# EAGLE schematic harp analog input v1.0 (EAGLE 9.6.2)

## Sheet 1 of 3
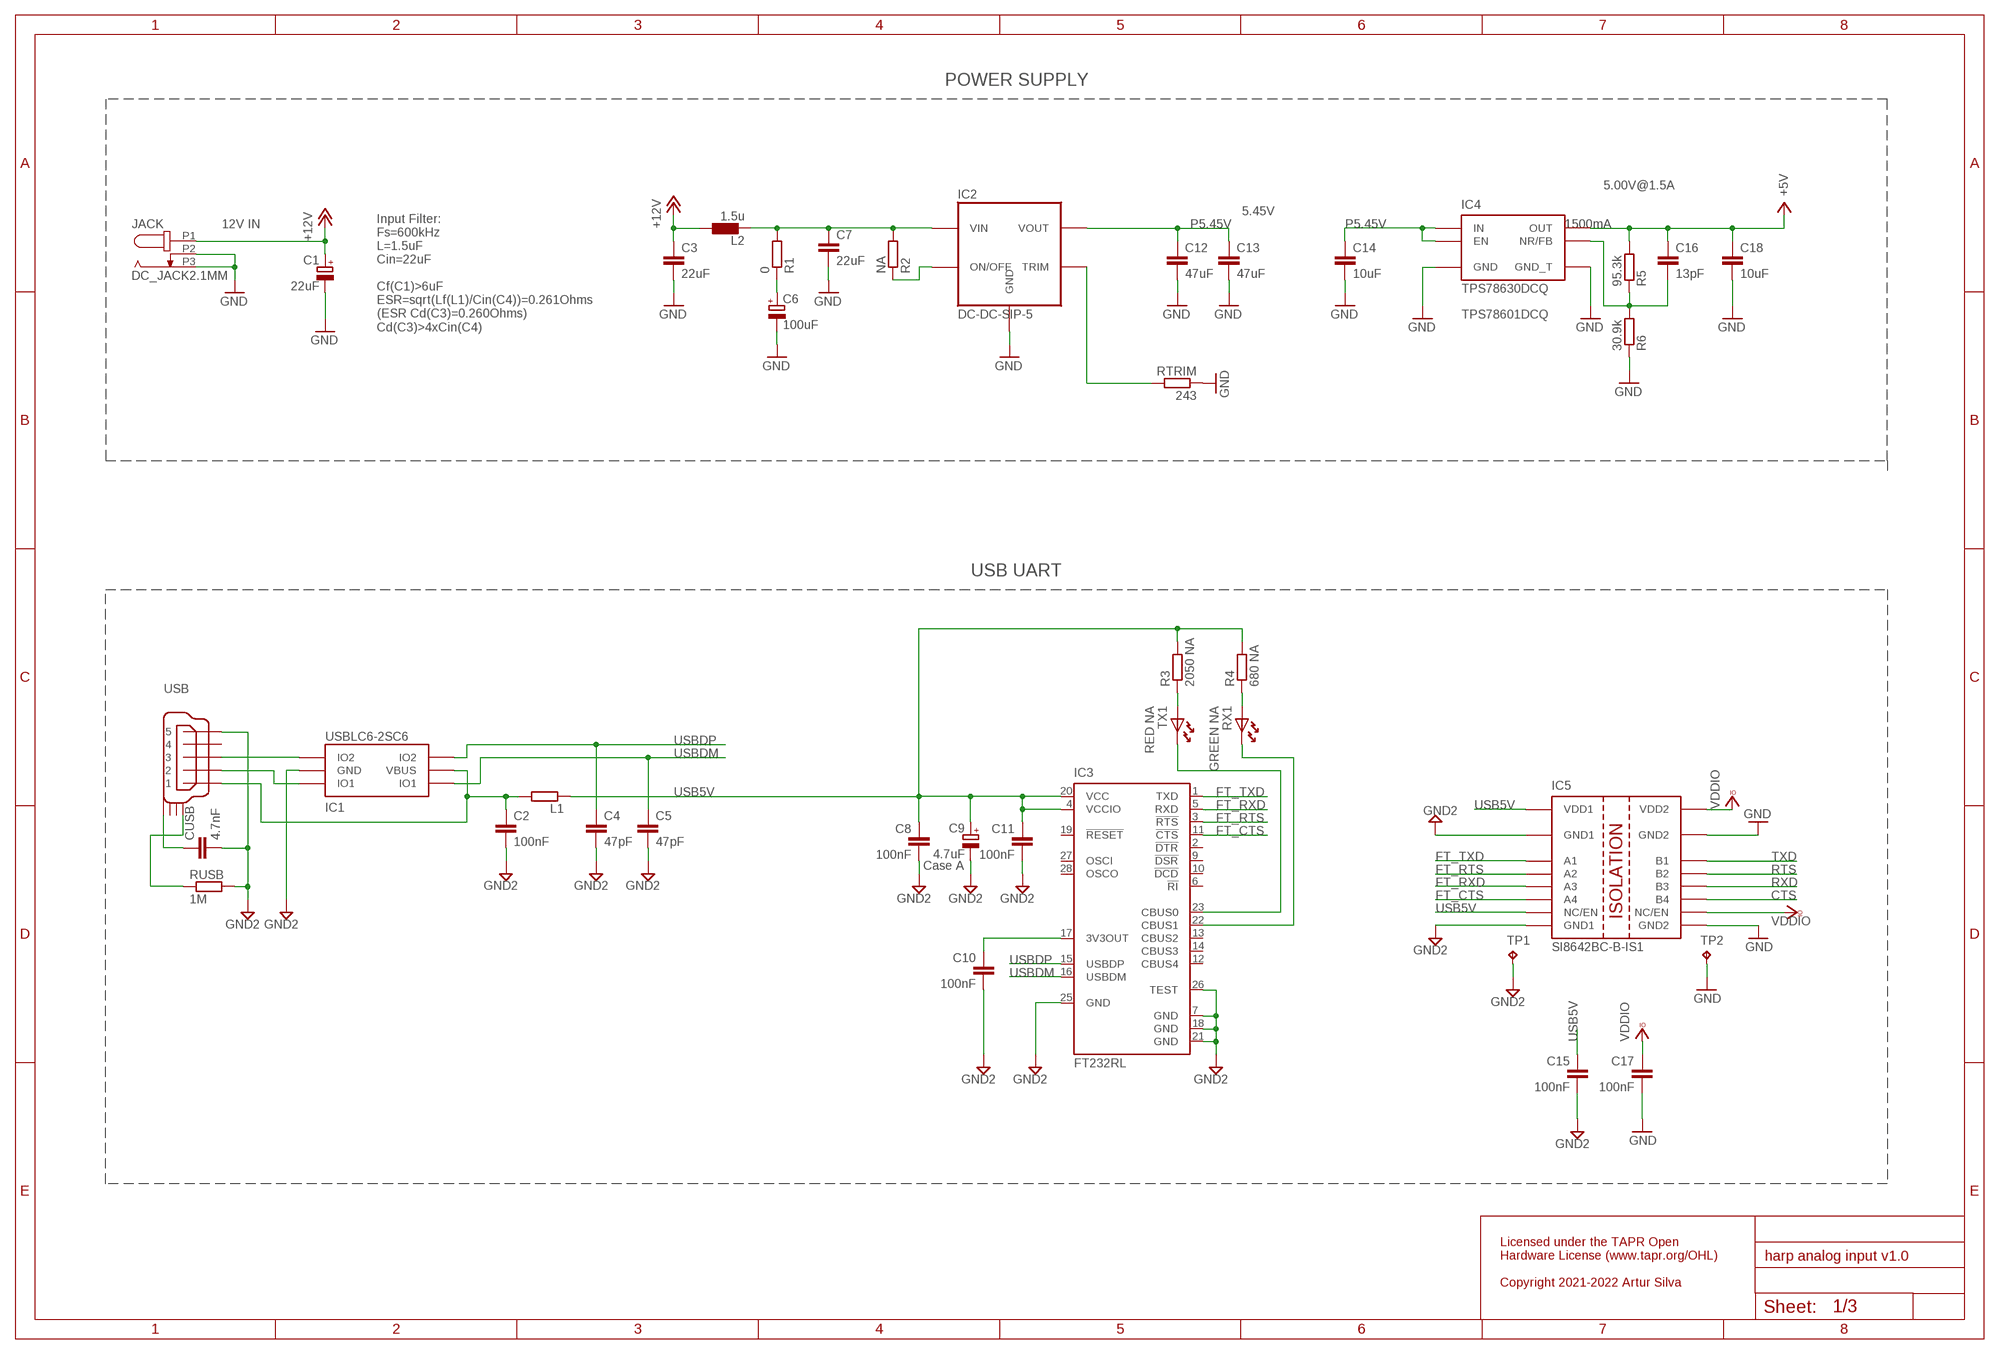
[diagram p0: schematic, sheet 1]

### Parts
C1  22uF  CAP_100UFHAND  [CAP_100UF_HAND]
C2  100nF  C-EUC0402  [C0402]
C3  22uF  C-EUC1210  [C1210]
C4  47pF  C-EUC0402  [C0402]
C5  47pF  C-EUC0402  [C0402]
C6  100uF  CPOL-EUE  [PANASONIC_E]
C7  22uF  C-EUC1210  [C1210]
C8  100nF  C-EUC0402  [C0402]
C9  4.7uF  CPOL-EUA/3216-18W  [A/3216-18W]
C10  100nF  C-EUC0402  [C0402]
C11  100nF  C-EUC0402  [C0402]
C12  47uF  C-EUC1210  [C1210]
C13  47uF  C-EUC1210  [C1210]
C14  10uF  C-EUC0603  [C0603]
C15  100nF  C-EUC0402  [C0402]
C16  13pF  C-EUC0402  [C0402]
C17  100nF  C-EUC0402  [C0402]
C18  10uF  C-EUC0603  [C0603]
CUSB  4.7nF  C-EUC0402  [C0402]
IC1  USBLC6-2SC6  USBLC6-2  [SOT23-6L]
IC2  DC-DC-SIP-5  [SIP-5]
IC3  FT232RL  [SSOP28]
IC4  TPS78630DCQ  TPS78601SON  [SON-8]
IC5  SI8642BC-B-IS1  SI8645  [NSOIC-16]
JACK  DC_JACK2.1MM  [DC_POWER_INPUT_2.1MM]
L1  ???  R-EU_R0805  [R0805]
L2  1.5u  INDLPS4012  [IND_LPS4012]
R1  0  R-EU_R0402  [R0402]
R2  NA  R-EU_R0402  [R0402]
R3  2050 NA  R-EU_R0402  [R0402]
R4  680 NA  R-EU_R0402  [R0402]
R5  95.3k  R-EU_R0402  [R0402]
R6  30.9k  R-EU_R0402  [R0402]
RTRIM  243  R-EU_R0402  [R0402]
RUSB  1M  R-EU_R0402  [R0402]
RX1  GREEN NA  LEDHAND  [LED_HAND]
TP1  TPTP08SQ  [TP08SQ]
TP2  TPTP08SQ  [TP08SQ]
TX1  RED NA  LEDHAND  [LED_HAND]
USB  USB_MINI_B  [240-0002-1]

### Nets
3V3OUT: C10.1 IC3.17(3V3OUT)
+5V: C16.1 C18.1 IC4.P3(OUT) IC4.P4(OUT) R5.2 ; also sheet 2,3
+12V: C1.+ C3.1 JACK.P1 L2.1
CTS: IC5.11(B4) ; also sheet 2
DCIN: C7.1 IC2.P2(VIN) L2.2 R1.2 R2.2
FT_CTS: IC3.11(!CTS) IC5.6(A4)
FT_RTS: IC3.3(!RTS) IC5.4(A2)
FT_RXD: IC3.5(RXD) IC5.5(A3)
FT_TXD: IC3.1(TXD) IC5.3(A1)
GND: C1.- C3.2 C6.- C7.2 C12.2 C13.2 C14.2 C17.2 C18.2 IC2.P3(GND) IC4.P6(GND) IC4.P9(GND_T) IC5.9(GND2) IC5.15(GND2) JACK.P2 JACK.P3 R6.1 RTRIM.1 TP2.TP ; also sheet 2,3
GND2: C2.2 C4.2 C5.2 C8.2 C9.- C10.2 C11.2 C15.2 CUSB.2 IC1.P$2(GND) IC3.7(GND) IC3.18(GND) IC3.21(GND) IC3.25(GND) IC3.26(TEST) IC5.2(GND1) IC5.8(GND1) RUSB.2 TP1.TP USB.P$5
N$5: R4.1 RX1.A
N$7: IC3.22(CBUS1) RX1.K
N$12: IC2.P5(TRIM) RTRIM.2
N$13: IC1.P$3(IO2) USB.P$3
N$15: CUSB.1 USB.SHIELD_4
N$16: IC2.P1(ON/OFF) R2.1
N$20: C16.2 IC4.P5(NR/FB) R5.1 R6.2
N$24: C6.+ R1.1
N$60: C2.1 IC1.P$5(VBUS) L1.2 USB.P$1
N$401: R3.1 TX1.A
N$591: IC3.23(CBUS0) TX1.K
N$601: RUSB.1 USB.SHIELD_1
N$701: IC1.P$1(IO1) USB.P$2
P5.45V: C12.1 C13.1 C14.1 IC2.P4(VOUT) IC4.P1(IN) IC4.P2(IN) IC4.P8(EN)
RTS: IC5.13(B2) ; also sheet 2
RXD: IC5.12(B3) ; also sheet 2
TXD: IC5.14(B1) ; also sheet 2
USB5V: C8.1 C9.+ C11.1 C15.1 IC3.4(VCCIO) IC3.20(VCC) IC5.1(VDD1) IC5.7(NC/EN) L1.1 R3.2 R4.2
USBDM: C5.1 IC1.P$6(IO1) IC3.16(USBDM)
USBDP: C4.1 IC1.P$4(IO2) IC3.15(USBDP)
VCCIO: C17.1 IC5.10(NC/EN) IC5.16(VDD2) ; supply symbol labelled VDDIO ; also sheet 2,3
Unconnected: IC3.2(!DTR) IC3.6(!RI) IC3.9(!DSR) IC3.10(!DCD) IC3.12(CBUS4) IC3.13(CBUS2) IC3.14(CBUS3) IC3.19(!RESET) IC3.27(OSCI) IC3.28(OSCO) USB.P$4 USB.SHIELD_2 USB.SHIELD_3

### Notes on the sheet
- POWER SUPPLY
- 5.00V@1.5A
- 5.45V
- 12V IN | 1500mA
- TPS78601DCQ
- Input Filter:
  Fs=600kHz
  L=1.5uF
  Cin=22uF
  
  Cf(C1)>6uF
  ESR=sqrt(Lf(L1)/Cin(C4))=0.261Ohms
  (ESR Cd(C3)=0.260Ohms)
  Cd(C3)>4xCin(C4)
- USB UART
- Case A
- Licensed under the TAPR Open
  Hardware License (www.tapr.org/OHL)
  
  Copyright 2021-2022 Artur Silva

## Sheet 2 of 3
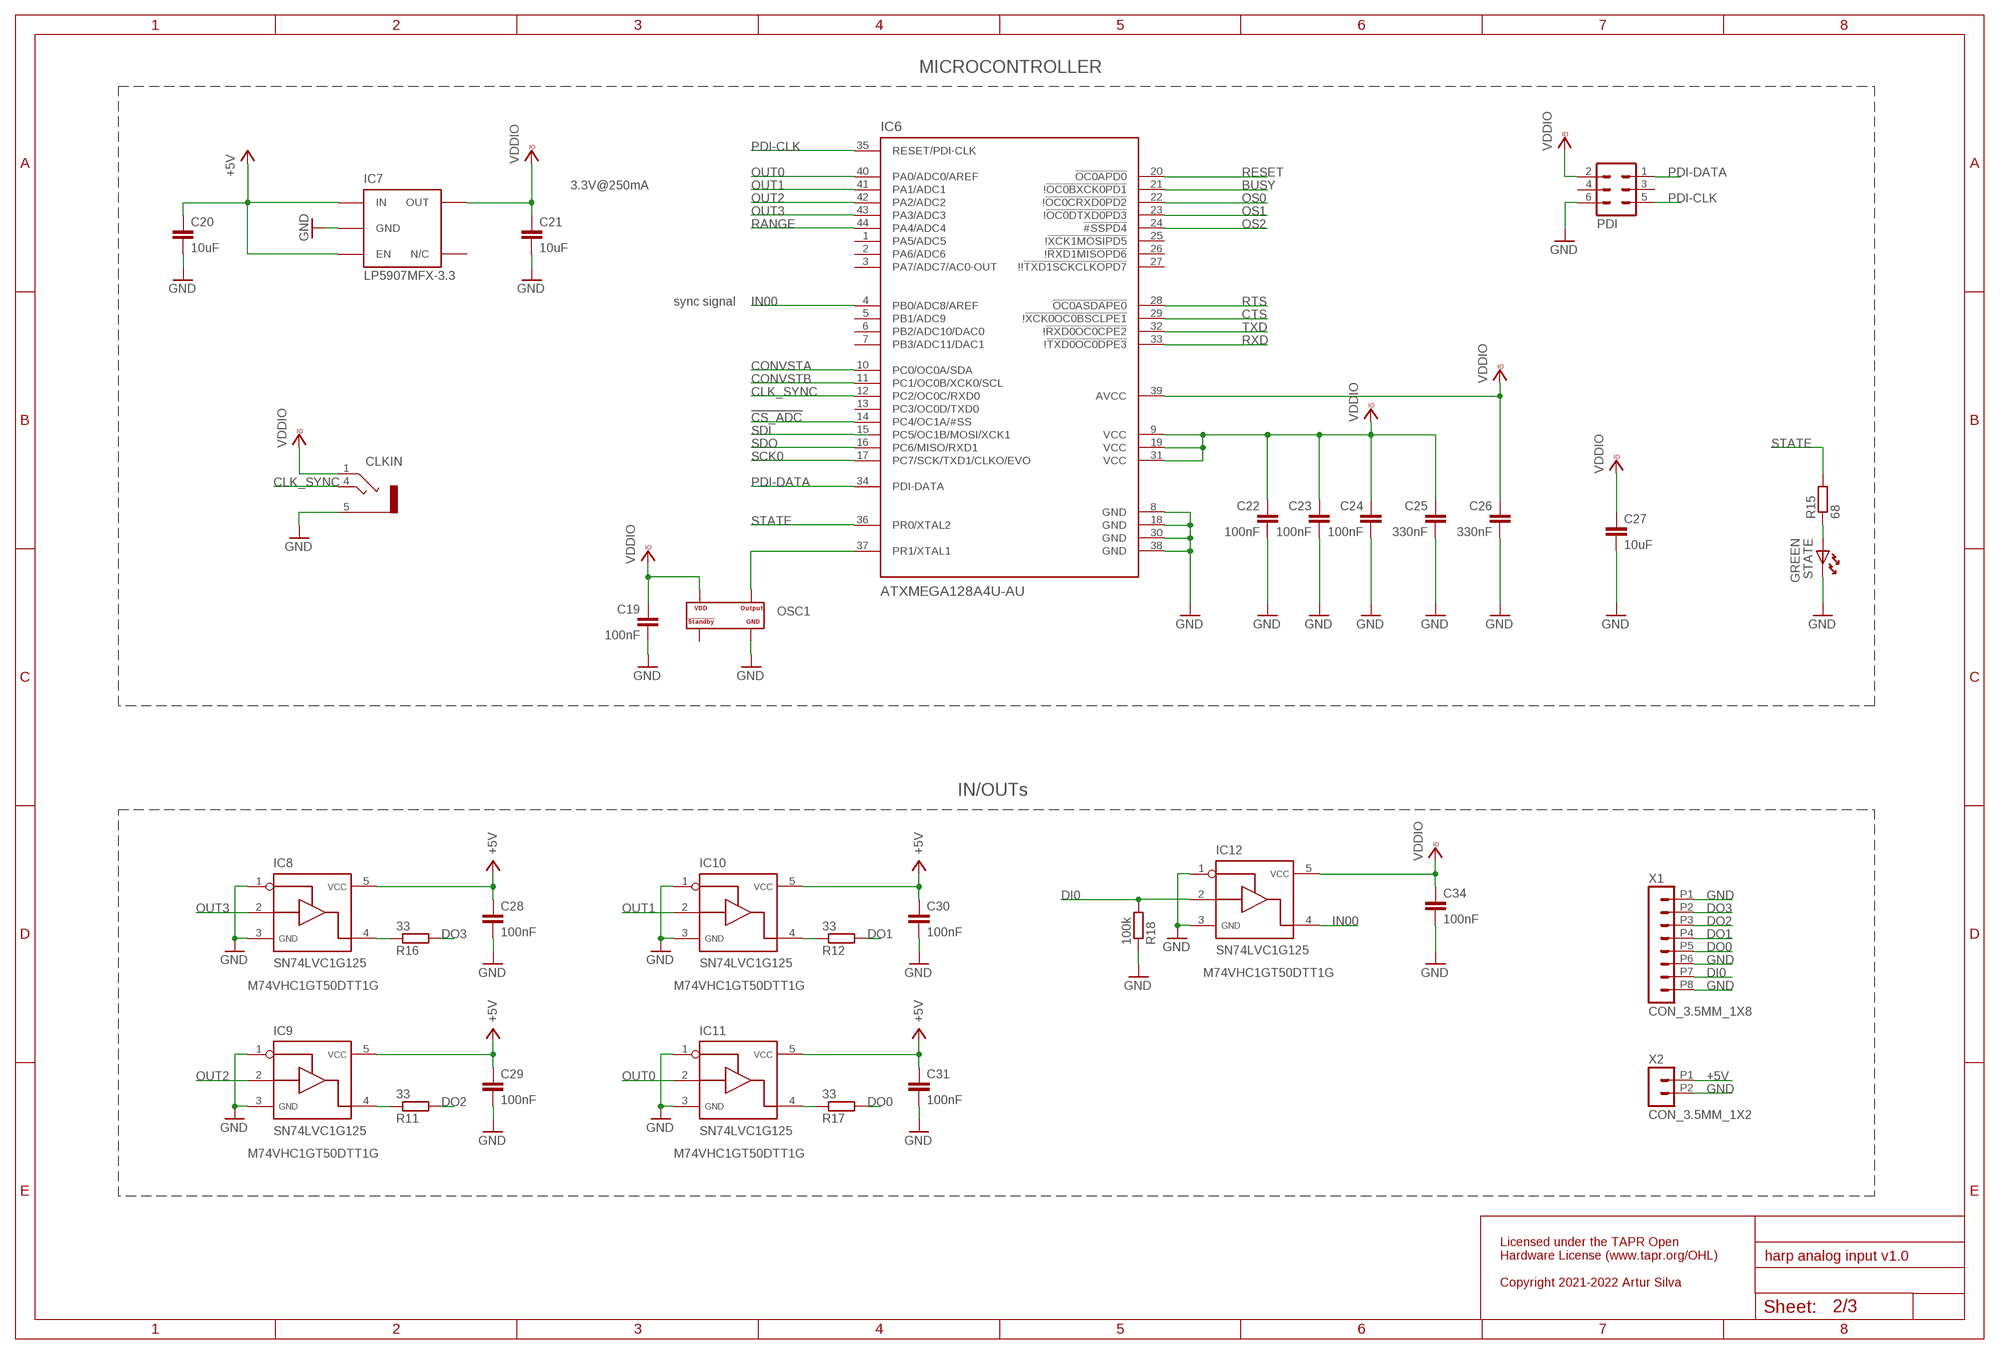
[diagram p1: schematic, sheet 2]

### Parts
C19  100nF  C-EUC0402  [C0402]
C20  10uF  C-EUC0603  [C0603]
C21  10uF  C-EUC0603  [C0603]
C22  100nF  C-EUC0402  [C0402]
C23  100nF  C-EUC0402  [C0402]
C24  100nF  C-EUC0402  [C0402]
C25  330nF  C-EUC0402  [C0402]
C26  330nF  C-EUC0402  [C0402]
C27  10uF  C-EUC0603  [C0603]
C28  100nF  C-EUC0402  [C0402]
C29  100nF  C-EUC0402  [C0402]
C30  100nF  C-EUC0402  [C0402]
C31  100nF  C-EUC0402  [C0402]
C34  100nF  C-EUC0402  [C0402]
CLKIN  STEREO_JACK  [35RASMT2BHNTRX]
IC6  ATXMEGA128A4U-AU  AT-XMEGA-XXA4-AU  [QFP80P1200X1200X120-44N]
IC7  LP5907MFX-3.3  TLV700XX  [TSOT23-5]
IC8  SN74LVC1G125  [SOT23-5]
IC9  SN74LVC1G125  [SOT23-5]
IC10  SN74LVC1G125  [SOT23-5]
IC11  SN74LVC1G125  [SOT23-5]
IC12  SN74LVC1G125  [SOT23-5]
OSC1  OSCILLATOR  [OSCILLATOR_3.2X2.5]
PDI  MA03-2  [MA03-2]
R11  33  R-EU_R0402  [R0402]
R12  33  R-EU_R0402  [R0402]
R15  68  R-EU_R0402  [R0402]
R16  33  R-EU_R0402  [R0402]
R17  33  R-EU_R0402  [R0402]
R18  100k  R-EU_R0402  [R0402]
STATE  GREEN  LEDHAND  [LED_HAND]
X1  CON_3.5MM_1X8  [CON_3.5MM_1X8]
X2  CON_3.5MM_1X2  [CON_3.5MM_1X2]

### Nets
!CS_ADC: IC6.14(PC4/OC1A/#SS) ; also sheet 3
+5V: C20.1 C28.1 C29.1 C30.1 C31.1 IC7.1(IN) IC7.3(EN) IC8.5 IC9.5 IC10.5 IC11.5 X2.P1 ; also sheet 1,3
BUSY: IC6.21(!!OC0BXCK0PD1) ; also sheet 3
CLK_SYNC: CLKIN.4 IC6.12(PC2/OC0C/RXD0)
CONVSTA: IC6.10(PC0/OC0A/SDA) ; also sheet 3
CONVSTB: IC6.11(PC1/OC0B/XCK0/SCL) ; also sheet 3
CTS: IC6.29(!!XCK0OC0BSCLPE1) ; also sheet 1
DI0: IC12.2 R18.2 X1.P7
DO0: R17.2 X1.P5
DO1: R12.2 X1.P4
DO2: R11.2 X1.P3
DO3: R16.2 X1.P2
GND: C19.2 C20.2 C21.2 C22.2 C23.2 C24.2 C25.2 C26.2 C27.2 C28.2 C29.2 C30.2 C31.2 C34.2 CLKIN.5 IC6.8(GND) IC6.18(GND) IC6.30(GND) IC6.38(GND) IC7.2(GND) IC8.1 IC8.3 IC9.1 IC9.3 IC10.1 IC10.3 IC11.1 IC11.3 IC12.1 IC12.3 OSC1.P$2(GND) PDI.6 R18.1 STATE.K X1.P1 X1.P6 X1.P8 X2.P2 ; also sheet 1,3
IN00: IC6.4(PB0/ADC8/AREF) IC12.4
N$2: IC9.4 R11.1
N$3: IC10.4 R12.1
N$4: IC11.4 R17.1
N$11: IC8.4 R16.1
N$23: R15.1 STATE.A
OS0: IC6.22(!!OC0CRXD0PD2) ; also sheet 3
OS1: IC6.23(!!OC0DTXD0PD3) ; also sheet 3
OS2: IC6.24(!#SSPD4) ; also sheet 3
OSC1: IC6.37(PR1/XTAL1) OSC1.P$3(OUTPUT)
OUT0: IC6.40(PA0/ADC0/AREF) IC11.2
OUT1: IC6.41(PA1/ADC1) IC10.2
OUT2: IC6.42(PA2/ADC2) IC9.2
OUT3: IC6.43(PA3/ADC3) IC8.2
PDI-CLK: IC6.35(RESET/PDI-CLK) PDI.5
PDI-DATA: IC6.34(PDI-DATA) PDI.1
RANGE: IC6.44(PA4/ADC4) ; also sheet 3
RESET: IC6.20(!OC0APD0) ; also sheet 3
RTS: IC6.28(!OC0ASDAPE0) ; also sheet 1
RXD: IC6.33(!!TXD0OC0DPE3) ; also sheet 1
SCK0: IC6.17(PC7/SCK/TXD1/CLKO/EVO) ; also sheet 3
SDI: IC6.15(PC5/OC1B/MOSI/XCK1)
SDO: IC6.16(PC6/MISO/RXD1) ; also sheet 3
STATE: IC6.36(PR0/XTAL2) R15.2
TXD: IC6.32(!!RXD0OC0CPE2) ; also sheet 1
VCCIO: C19.1 C21.1 C22.1 C23.1 C24.1 C25.1 C26.1 C27.1 C34.1 CLKIN.1 IC6.9(VCC) IC6.19(VCC) IC6.31(VCC) IC6.39(AVCC) IC7.5(OUT) IC12.5 OSC1.P$4(VDD) PDI.2 ; supply symbol labelled VDDIO ; also sheet 1,3
Unconnected: IC6.1(PA5/ADC5) IC6.2(PA6/ADC6) IC6.3(PA7/ADC7/AC0-OUT) IC6.5(PB1/ADC9) IC6.6(PB2/ADC10/DAC0) IC6.7(PB3/ADC11/DAC1) IC6.13(PC3/OC0D/TXD0) IC6.25(!!XCK1MOSIPD5) IC6.26(!!RXD1MISOPD6) IC6.27(!!!TXD1SCKCLKOPD7) IC7.4(N/C) OSC1.P$1(STANDBY#) PDI.3 PDI.4

### Notes on the sheet
- MICROCONTROLLER
- 3.3V@250mA
- sync signal
- IN/OUTs
- M74VHC1GT50DTT1G
- M74VHC1GT50DTT1G | M74VHC1GT50DTT1G
- M74VHC1GT50DTT1G | M74VHC1GT50DTT1G
- Licensed under the TAPR Open
  Hardware License (www.tapr.org/OHL)
  
  Copyright 2021-2022 Artur Silva

## Sheet 3 of 3
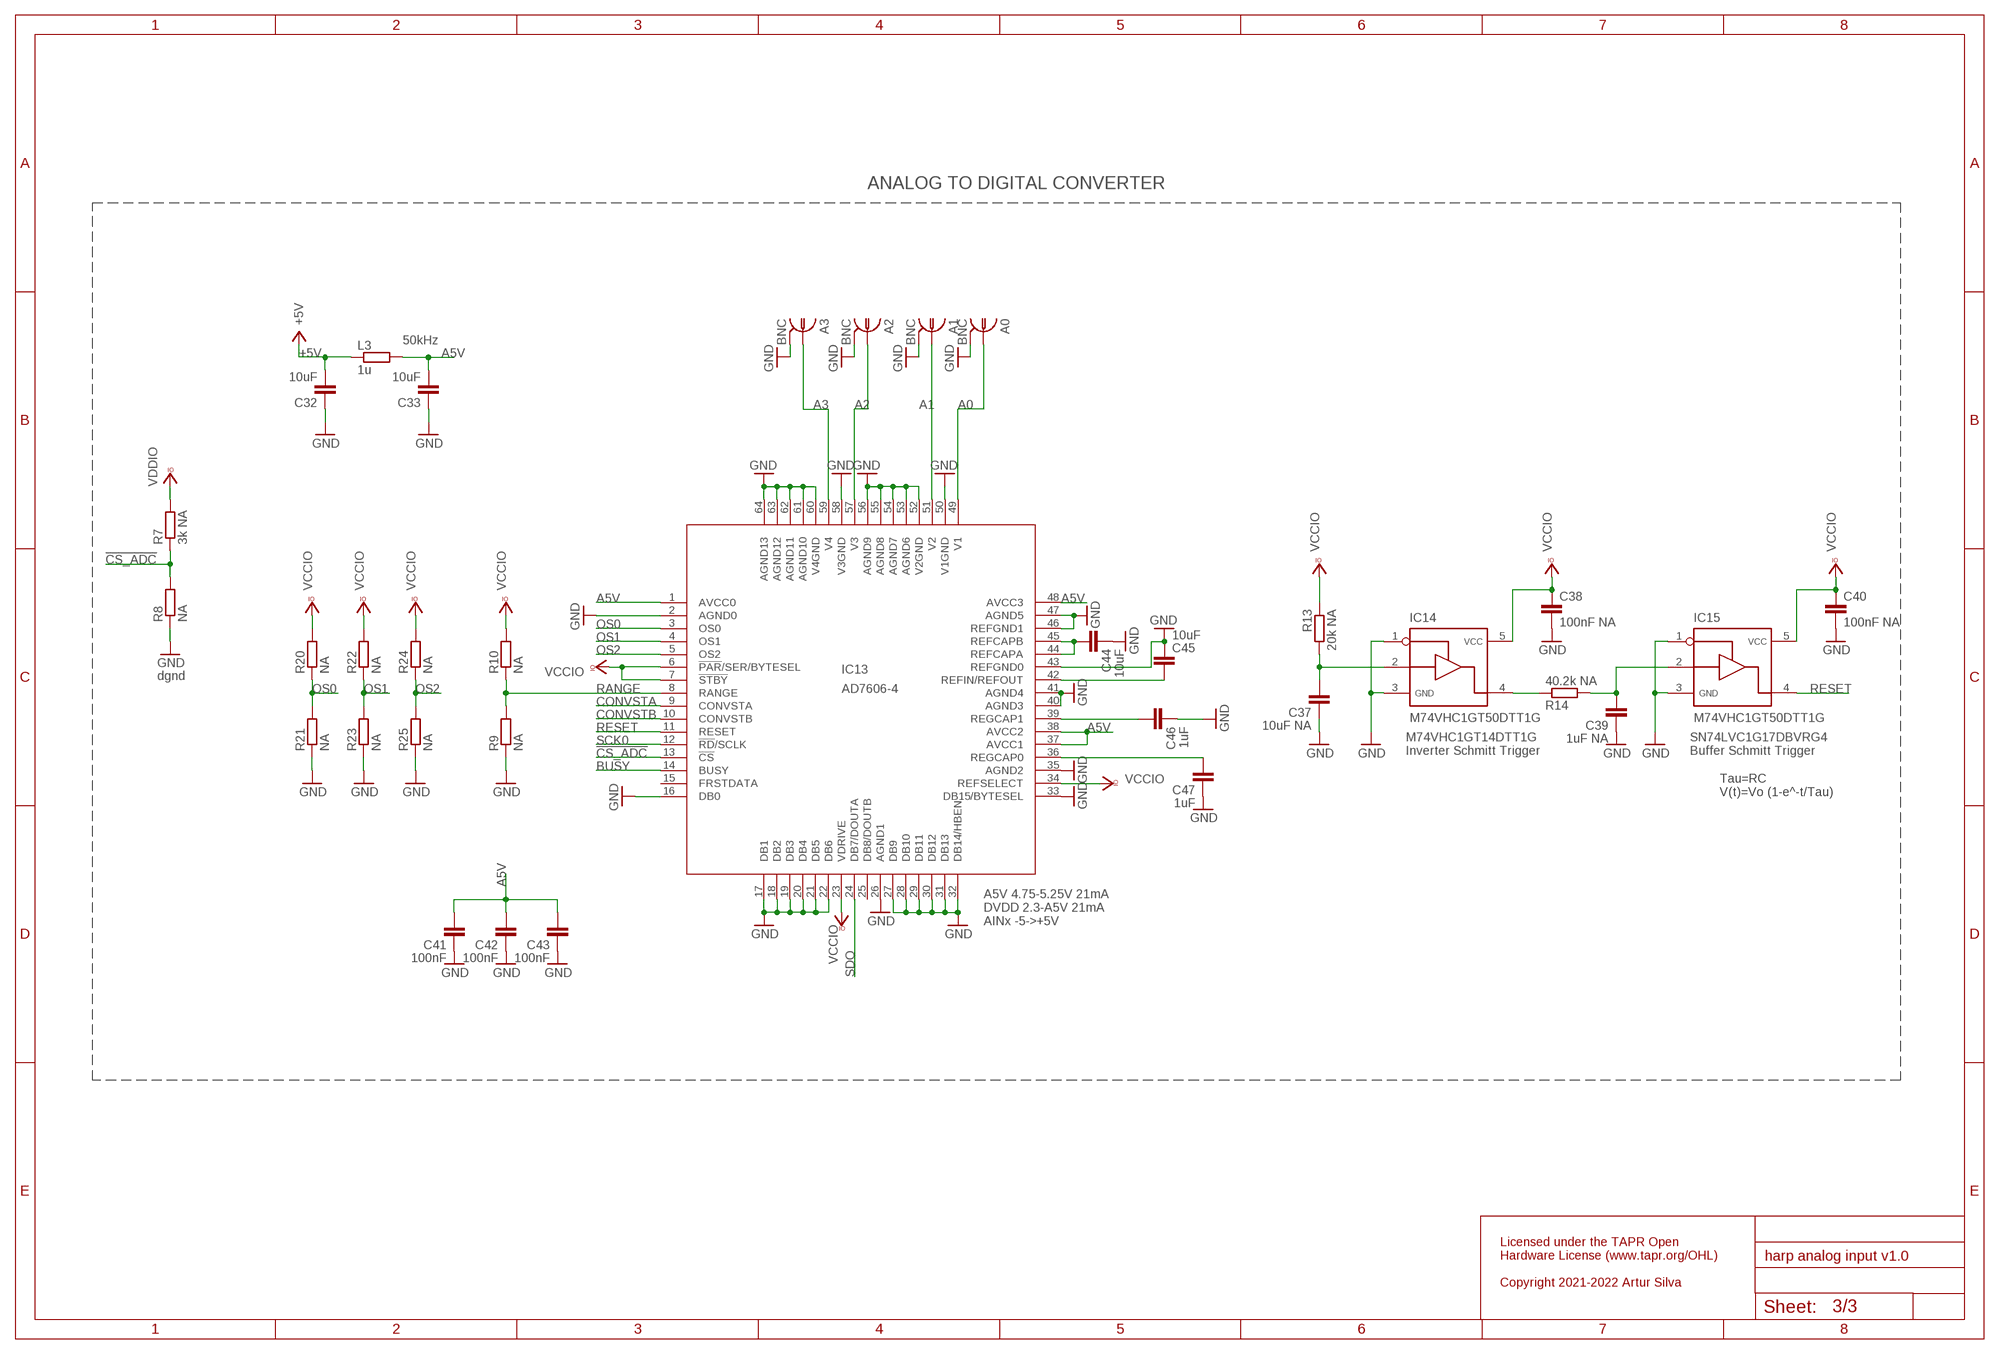
[diagram p2: schematic, sheet 3]

### Parts
A0  BNC  [BNC_RA]
A1  BNC  [BNC_RA]
A2  BNC  [BNC_RA]
A3  BNC  [BNC_RA]
C32  10uF  C-EUC0603  [C0603]
C33  10uF  C-EUC0603  [C0603]
C37  10uF NA  C-EUC0603  [C0603]
C38  100nF NA  C-EUC0402  [C0402]
C39  1uF NA  C-EUC0402  [C0402]
C40  100nF NA  C-EUC0402  [C0402]
C41  100nF  C-EUC0402  [C0402]
C42  100nF  C-EUC0402  [C0402]
C43  100nF  C-EUC0402  [C0402]
C44  10uF  C-EUC0603  [C0603]
C45  10uF  C-EUC0603  [C0603]
C46  1uF  C-EUC0402  [C0402]
C47  1uF  C-EUC0402  [C0402]
IC13  AD7606-4  [LQFP-64]
IC14  M74VHC1GT50DTT1G  SN74LVC1G125  [SOT23-5]
IC15  M74VHC1GT50DTT1G  SN74LVC1G125  [SOT23-5]
L3  1u  R-EU_R0402  [R0402]
R7  3k NA  R-EU_R0402  [R0402]
R8  NA  R-EU_R0402  [R0402]
R9  NA  R-EU_R0402  [R0402]
R10  NA  R-EU_R0402  [R0402]
R13  20k NA  R-EU_R0402  [R0402]
R14  40.2k NA  R-EU_R0402  [R0402]
R20  NA  R-EU_R0402  [R0402]
R21  NA  R-EU_R0402  [R0402]
R22  NA  R-EU_R0402  [R0402]
R23  NA  R-EU_R0402  [R0402]
R24  NA  R-EU_R0402  [R0402]
R25  NA  R-EU_R0402  [R0402]

### Nets
!CS_ADC: IC13.13(!CS) R7.1 R8.2 ; also sheet 2
+5V: C32.2 L3.1 ; also sheet 1,2
A0: A0.1 IC13.49(V1)
A1: A1.1 IC13.51(V2)
A2: A2.1 IC13.57(V3)
A3: A3.1 IC13.59(V4)
A5V: C33.2 C41.2 C42.2 C43.2 IC13.1(AVCC0) IC13.37(AVCC1) IC13.38(AVCC2) IC13.48(AVCC3) L3.2
BUSY: IC13.14(BUSY) ; also sheet 2
CONVSTA: IC13.9(CONVSTA) ; also sheet 2
CONVSTB: IC13.10(CONVSTB) ; also sheet 2
GND: A0.2 A1.2 A2.2 A3.2 C32.1 C33.1 C37.1 C38.2 C39.1 C40.2 C41.1 C42.1 C43.1 C44.1 C45.1 C46.1 C47.1 IC13.2(AGND0) IC13.16(DB0) IC13.17(DB1) IC13.18(DB2) IC13.19(DB3) IC13.20(DB4) IC13.21(DB5) IC13.22(DB6) IC13.26(AGND1) IC13.27(DB9) IC13.28(DB10) IC13.29(DB11) IC13.30(DB12) IC13.31(DB13) IC13.32(DB14/HBEN) IC13.33(DB15/BYTESEL) IC13.35(AGND2) IC13.40(AGND3) IC13.41(AGND4) IC13.43(REFGND0) IC13.46(REFGND1) IC13.47(AGND5) IC13.50(V1GND) IC13.52(V2GND) IC13.53(AGND6) IC13.54(AGND7) IC13.55(AGND8) IC13.56(AGND9) IC13.58(V3GND) IC13.60(V4GND) IC13.61(AGND10) IC13.62(AGND11) IC13.63(AGND12) IC13.64(AGND13) IC14.1 IC14.3 IC15.1 IC15.3 R8.1 R9.1 R21.1 R23.1 R25.1 ; also sheet 1,2
N$36: C47.2 IC13.36(REGCAP0)
N$37: C46.2 IC13.39(REGCAP1)
N$38: C45.2 IC13.42(REFIN/REFOUT)
N$39: C44.2 IC13.44(REFCAPA) IC13.45(REFCAPB)
N$40: C37.2 IC14.2 R13.2
N$41: IC14.4 R14.1
N$43: C39.2 IC15.2 R14.2
OS0: IC13.3(OS0) R20.1 R21.2 ; also sheet 2
OS1: IC13.4(OS1) R22.1 R23.2 ; also sheet 2
OS2: IC13.5(OS2) R24.1 R25.2 ; also sheet 2
RANGE: IC13.8(RANGE) R9.2 R10.1 ; also sheet 2
RESET: IC13.11(RESET) IC15.4 ; also sheet 2
SCK0: IC13.12(!RD!/SCLK) ; also sheet 2
SDO: IC13.24(DB7/DOUTA) ; also sheet 2
VCCIO: C38.1 C40.1 IC13.6(!PAR!/SER/BYTESEL) IC13.7(!STBY) IC13.23(VDRIVE) IC13.34(REFSELECT) IC14.5 IC15.5 R7.2 R10.2 R13.1 R20.2 R22.2 R24.2 ; supply symbol labelled VDDIO ; also sheet 1,2
Unconnected: IC13.15(FRSTDATA) IC13.25(DB8/DOUTB)

### Notes on the sheet
- ANALOG TO DIGITAL CONVERTER
- 50kHz
- dgnd
- M74VHC1GT14DTT1G
  Inverter Schmitt Trigger
- SN74LVC1G17DBVRG4
  Buffer Schmitt Trigger
- Tau=RC
  V(t)=Vo (1-e^-t/Tau)
- A5V 4.75-5.25V 21mA
  DVDD 2.3-A5V 21mA
  AINx -5->+5V
- Licensed under the TAPR Open
  Hardware License (www.tapr.org/OHL)
  
  Copyright 2021-2022 Artur Silva

## Library data of the parts
A0 A1-A3 = CNP-connectors:BNC
C1 = CNP-miscellaneous:CAP_100UF
C2-C5 C7 C8 C10-C34 C37-C47 CUSB = rcl:C-EU: CAPACITOR, European symbol
C6 C9 = rcl:CPOL-EU: POLARIZED CAPACITOR, European symbol
CLKIN = CNP-connectors:STEREO_JACK
IC1 = CNP 2:USBLC6-2
IC2 = CNP-connectors:DC-DC-SIP-5
IC3 = ftdichip:FT232R: Source: http://www.ftdichip.com/Documents/DataSheets/DS_FT232R_v104.pdf; MPN: FT232RL; OC_FARNELL: 1146032; OC_NEWARK: 91K9918
IC4 = CNP-ics 1:TPS78601
IC5 = CNP-ics 2:SI8645
IC6 = xmega-a4:AT-XMEGA-XXA4-AU: ATxMega a4 Serie
IC7 = CNP:TLV700XX
IC8-IC12 IC14 IC15 = My_library 0v2:SN74LVC1G125
IC13 = CNP-ics 1:AD7606-4
JACK = CNP-miscellaneous:DC_JACK
L1 L3 R1-R18 R20-R25 RTRIM RUSB = rcl:R-EU_: RESISTOR, European symbol
L2 = CNP-miscellaneous:IND
OSC1 = CNP-miscellaneous:OSCILLATOR
PDI = con-lstb:MA03-2: PIN HEADER; OC_FARNELL: unknown; OC_NEWARK: unknown
RX1 STATE TX1 = CNP-miscellaneous:LED
TP1 TP2 = testpad:TP: Test pad
USB = CNP-connectors:USB_MINI_B
X1 = CNP-connectors:CON_3.5MM_1X8
X2 = CNP-connectors:CON_3.5MM_1X2